# Altium schematic sheet Log and Anti-Log Converters.SchDoc
size Letter; SheetNumber: 4; SheetTotal: 10
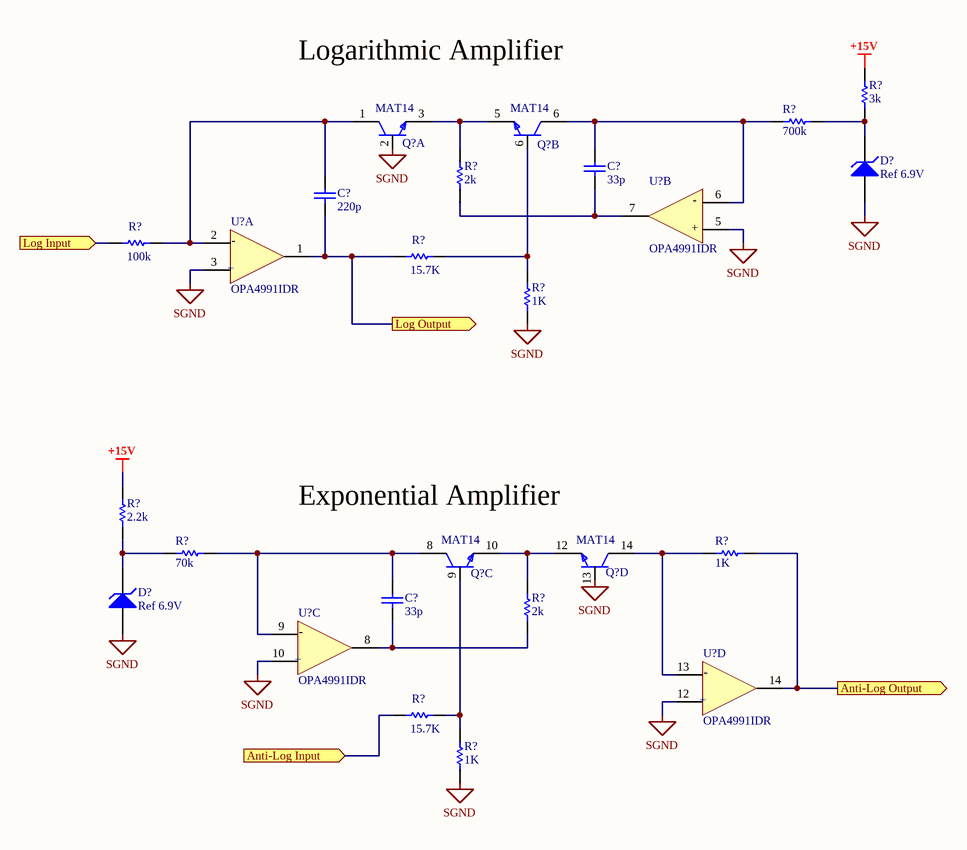
[diagram p0: Log and Anti-Log Converters.SchDoc]

## Parts
(Parts that share a designator on the sheet are numbered #1, #2 ... from top to bottom, then left to right.)
C?#1  value 33p  (hidden comment: Capacitor)
C?#2  value 220p  (hidden comment: Capacitor)
C?#3  value 33p  (hidden comment: Capacitor)
D?#1  BV: Ref 6.9V  (hidden comment: Zener Diode)
D?#2  BV: Ref 6.9V  (hidden comment: Zener Diode)
Q?#1  MAT14  [FP-R-14-IPC_B]  (part A of 5)
Q?#2  MAT14  [FP-R-14-IPC_B]  (part B of 5)
Q?#3  MAT14  [FP-R-14-IPC_B]  (part C of 5)
Q?#4  MAT14  [FP-R-14-IPC_B]  (part D of 5)
R?#1  value 3k  (hidden comment: Resistor)
R?#2  value 700k  (hidden comment: Resistor)
R?#3  value 2k  (hidden comment: Resistor)
R?#4  value 100k  (hidden comment: Resistor)
R?#5  value 15.7K  (hidden comment: Resistor)
R?#6  value 1K  (hidden comment: Resistor)
R?#7  value 2.2k  (hidden comment: Resistor)
R?#8  value 70k  (hidden comment: Resistor)
R?#9  value 1K  (hidden comment: Resistor)
R?#10  value 2k  (hidden comment: Resistor)
R?#11  value 15.7K  (hidden comment: Resistor)
R?#12  value 1K  (hidden comment: Resistor)
U?#1  OPA4991IDR  [FP-D0014A-IPC_B]  (part B of 5)
U?#2  OPA4991IDR  [FP-D0014A-IPC_B]  (part A of 5)
U?#3  OPA4991IDR  [FP-D0014A-IPC_B]  (part C of 5)
U?#4  OPA4991IDR  [FP-D0014A-IPC_B]  (part D of 5)

## Ports
Anti-Log Input (in), Anti-Log Output (out), Log Input (in), Log Output (out)

## Nets
+15V: R?#1.1 R?#7.1
SGND: D?#1.1(A) D?#2.1(A) Q?#1.2(B1) Q?#4.13(B4) R?#6.1 R?#12.1 U?#1.5(IN2+) U?#2.3(IN1+) U?#3.10(IN3+) U?#4.12(IN4+)
Anti-Log Input: R?#11.2 ; port Anti-Log Input
Anti-Log Output: R?#9.2 U?#4.14(OUT4) ; port Anti-Log Output
Log Input: R?#4.2 ; port Log Input
Log Output: C?#2.1 R?#5.2 U?#2.1(OUT1) ; port Log Output
NetC?#1_1: C?#1.1 R?#3.1 U?#1.7(OUT2)
NetC?#1_2: C?#1.2 Q?#2.6(C2) R?#2.2 U?#1.6(IN2-)
NetC?#2_2: C?#2.2 Q?#1.1(C1) R?#4.1 U?#2.2(IN1-)
NetC?#3_1: C?#3.1 R?#10.1 U?#3.8(OUT3)
NetC?#3_2: C?#3.2 Q?#3.8(C3) R?#8.1 U?#3.9(IN3-)
NetD?#1_2: D?#1.2(K) R?#1.2 R?#2.1
NetD?#2_2: D?#2.2(K) R?#7.2 R?#8.2
NetQ?#1_3: Q?#1.3(E1) Q?#2.5(E2) R?#3.2
NetQ?#2_6: Q?#2.6(B2) R?#5.1 R?#6.2
NetQ?#3_9: Q?#3.9(B3) R?#11.1 R?#12.2
NetQ?#3_10: Q?#3.10(E3) Q?#4.12(E4) R?#10.2
NetQ?#4_14: Q?#4.14(C4) R?#9.1 U?#4.13(IN4-)

## Notes on the sheet
- Logarithmic Amplifier
- (near Q?#3) Exponential Amplifier
- (in symbol OPA4991IDR, part A) -; +
- (in symbol OPA4991IDR, part B) -; +
- (in symbol OPA4991IDR, part C) -; +
- (in symbol OPA4991IDR, part D) -; +

## Library data of the parts
C?#1-C?#3 = Capacitor: SimulationGenericComponent: True
D?#1 D?#2 = Zener Diode: AF: 1; BV_MAX: 1e99; CJO: 0; EG: 1.11; FC: 0.5; IBV: 0.001; IS: 1e-14; MJSW: 0.33; NTUN: 30; TNOM: 27; XTI: 3; SimulationGenericComponent: True; CJP: 0; CTA: 0; CTP: 0; FCS: 0.5; FV_MAX: 1e99; IKF: 0; IKR: 0; ISR: 1e-14; JSW: 0; JTUN: 0; JTUNSW: 0; KEG: 1; KF: 0; LEVEL: 1; N: 1; NBV: 1; NR: 1; NS: 1; PHP: 1; RS: 0; TCV: 0; TLEV: 0; TLEVC: 0; TM1: 0; TM2: 0; TPB: 0; TPHP: 0; TRS: 0; TRS2: 0; TT: 0; TTT1: 0; TTT2: 0; VJ: 1; XTITUN: 3
Q?#1-Q?#4 = MAT14ARZ: TRANS 4NPN 40V 0.03A 14SO; Transition Frequency: 300MHz; Max Collector Current: 30mA; Max Frequency: 1kHz; Collector-emitter Voltage-Max: 60mV; Number of Elements: 4; Polarity: NPN; Max Operating Temperature: 85°C; Collector Emitter Voltage (VCEO): 40V; Collector Emitter Breakdown Voltage: 40V; REACH SVHC: No SVHC; Series: MAT14; Collector Base Voltage (VCBO): 40V; Mount: Surface Mount; Packaging: Rail/Tube; Package Quantity: 56; Case/Package: SOIC; Min Operating Temperature: -40°C; Length: 8.75mm; RoHS Compliant: Yes; Frequency: 300MHz; Radiation Hardening: No; Lead Free: Contains Lead; Collector Emitter Saturation Voltage: 60mV; Height: 1.5mm; Width: 4mm; Number of Pins: 14
R?#1-R?#12 = Resistor: TC1: 0; SimulationGenericComponent: True; TC2: 0
U?#1-U?#4 = OPA4991IDR: 40-V, DUAL 4.5MHZ, RAIL-TO-RAIL